# EAGLE design coil-control-UNO-shield-v1 (EAGLE 7.1.0)
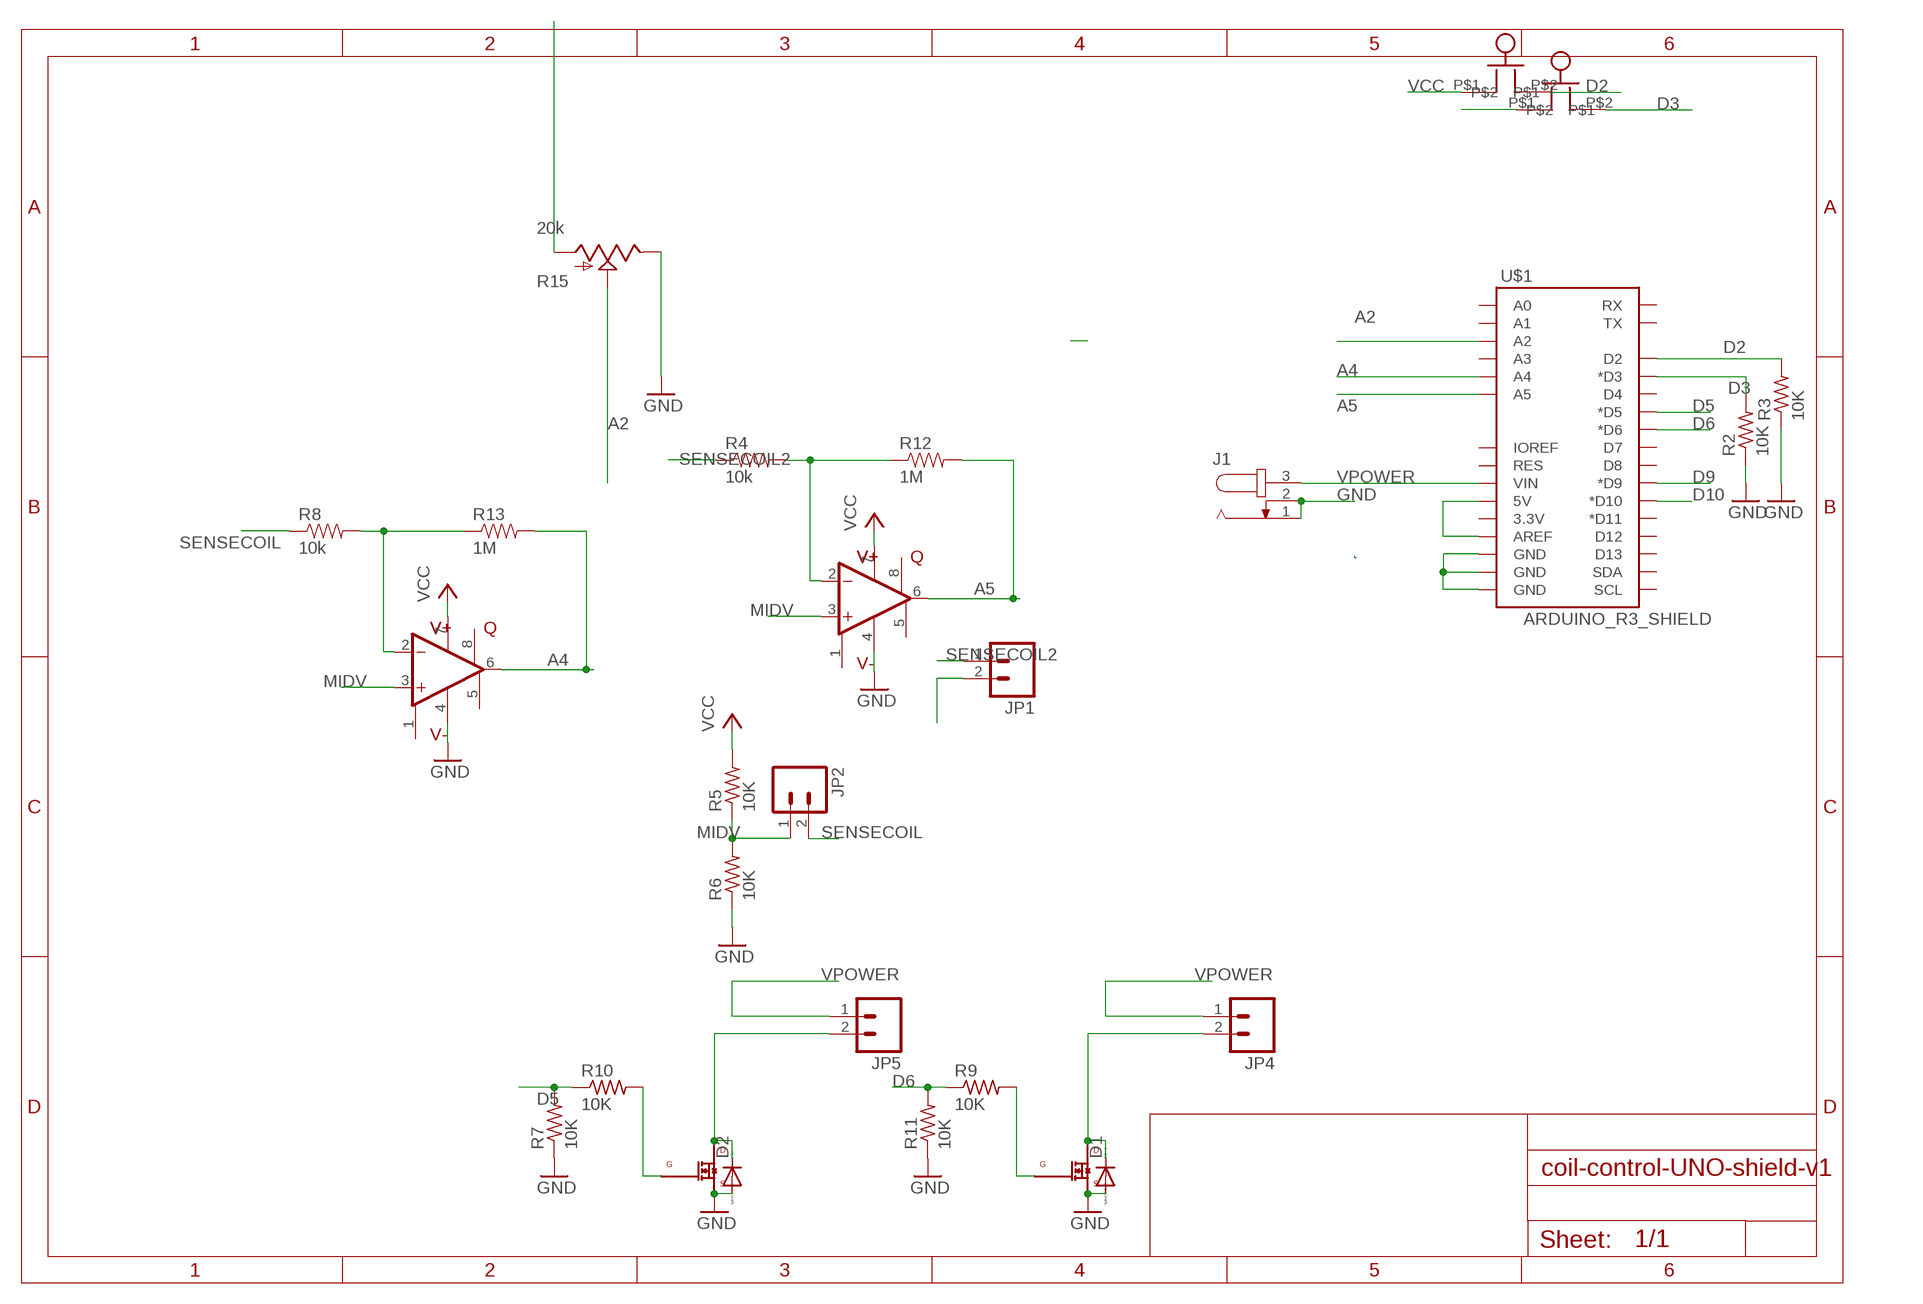
[diagram p0: schematic, sheet 1]

## Parts
D1  DIODE-DO-214AC  [DO-214AC]
D2  DIODE-DO-214AC  [DO-214AC]
J1  JACK-PLUG1  [SPC4078]
JP1  M02PTH  [1X02]
JP2  M02PTH  [1X02]
JP4  M02PTH  [1X02]
JP5  M02PTH  [1X02]
Q1  IRLML0060  [SOT-23]
Q2  IRLML0060  [SOT-23]
R2  10K  R-US_R0603  [R0603]
R3  10K  R-US_R0603  [R0603]
R4  10k  RESISTOR0603  [0603-RES]
R5  10K  R-US_R0603  [R0603]
R6  10K  R-US_R0603  [R0603]
R7  10K  R-US_R0603  [R0603]
R8  10k  RESISTOR0603  [0603-RES]
R9  10K  R-US_R0603  [R0603]
R10  10K  R-US_R0603  [R0603]
R11  10K  R-US_R0603  [R0603]
R12  1M  RESISTOR0805-RES  [0805]
R13  1M  RESISTOR0805-RES  [0805]
R15  20k  POTALPS-KIT  [ALPS_POT_KIT]
SW2  BUTTON  [BUTTON]
SW3  BUTTON  [BUTTON]
U2  LM4250  [DIP08]
U3  LM4250  [DIP08]
U$1  ARDUINO_R3_SHIELD  [UNO_R3_SHIELD]

## Nets
A2: R15.P$2(S) U$1.A2
A4: R13.2 U2.6(OUT) U$1.A4
A5: R12.2 U3.6(OUT) U$1.A5
D2: R3.2 SW2.P$2 U$1.D2
D3: R2.2 SW3.P$2 U$1.D3(*D3)
D5: R7.2 R10.1 U$1.D5(*D5)
D6: R9.1 R11.2 U$1.D6(*D6)
D9: U$1.D9(*D9)
D10: U$1.D10(*D10)
GND: D1.A D2.A J1.1 J1.2 Q1.2(SOURCE) Q2.2(SOURCE) R2.1 R3.1 R6.1 R7.1 R11.1 R15.P$1(E) U2.4(V-) U3.4(V-) U$1.GND@0(GND) U$1.GND@1(GND) U$1.GND@2(GND)
MIDV: JP1.2 JP2.1 R5.1 R6.2 U2.3(+IN) U3.3(+IN)
N$3: R4.2 R12.1 U3.2(-IN)
N$13: Q1.1(GATE) R9.2
N$14: R8.2 R13.1 U2.2(-IN)
N$15: D1.C JP4.2 Q1.3(DRAIN)
N$17: Q2.1(GATE) R10.2
N$18: D2.C JP5.2 Q2.3(DRAIN)
SENSECOIL: JP2.2 R8.1
SENSECOIL2: JP1.1 R4.1
VCC: R5.2 R15.P$3(A) SW2.P$1 SW3.P$1 U2.7(V+) U3.7(V+) U$1.5V U$1.AREF
VPOWER: J1.3 JP4.1 JP5.1 U$1.VIN
Unconnected: U2.1(NULL1) U2.5(NULL2) U2.8(QUIES) U3.1(NULL1) U3.5(NULL2) U3.8(QUIES) U$1.3.3V U$1.A0 U$1.A1 U$1.A3 U$1.D4 U$1.D7 U$1.D8 U$1.D11(*D11) U$1.D12 U$1.D13 U$1.IOREF U$1.RES U$1.RX U$1.SCL U$1.SDA U$1.TX

## Library data of the parts
D1 D2 = diode:DIODE-: DIODE
J1 = con-jack:JACK-PLUG: DC POWER JACK Power Jack, DC, Right Angle, Through Hole, Rated 5A at 16VDC, PC Terminals Distributor: Farnell (www.Farnell.de) Drawing: 84N1161.pdf / 84N1162.pdf Manufacturer: SPC Technology (www.spctechnology.com) Type: SPC4077 / SPC 4078; OC_FARNELL: unknown; OC_NEWARK: unknown
JP1 JP2 JP4 JP5 = SparkFun-Connectors:M02: Standard 2-pin 0.1" header. Use with - straight break away headers ( PRT-00116) - right angle break away headers (PRT-00553) - swiss pins (PRT-00743) - machine pins (PRT-00117) - female headers (PRT-00115) Molex polarized connector foot print use with: PRT-08233 with associated crimp pins and housings. 2.54_SCREWTERM for use with PRT-10571. 3.5mm Screw Terminal footprints for PRT-08084 5mm Screw Terminal footprints for use with PRT-08432
Q1 Q2 = spietz-library:IRLML0060
R2 R3 R5-R7 R9-R11 = resistor:R-US_: RESISTOR, American symbol
R4 R8 = SparkFun-Resistors:RESISTOR: Resistor Basic schematic elements and footprints for 0603, 1206, and PTH resistors.
R12 R13 = SparkFun-Passives:RESISTOR: Resistor Basic schematic elements and footprints for 0603, 1206, and PTH resistors.
R15 = SparkFun-Electromechanical:POT
SW2 SW3 = spietz-library:BUTTON
U2 U3 = spietz-library:LM4250
U$1 = SparkFun-Boards:ARDUINO_R3_SHIELD: Shield form compatible with the Arduino Uno R3.

## Net classes
0 default: width 0.203 mm
1 vcc: width 0.254 mm

## Board
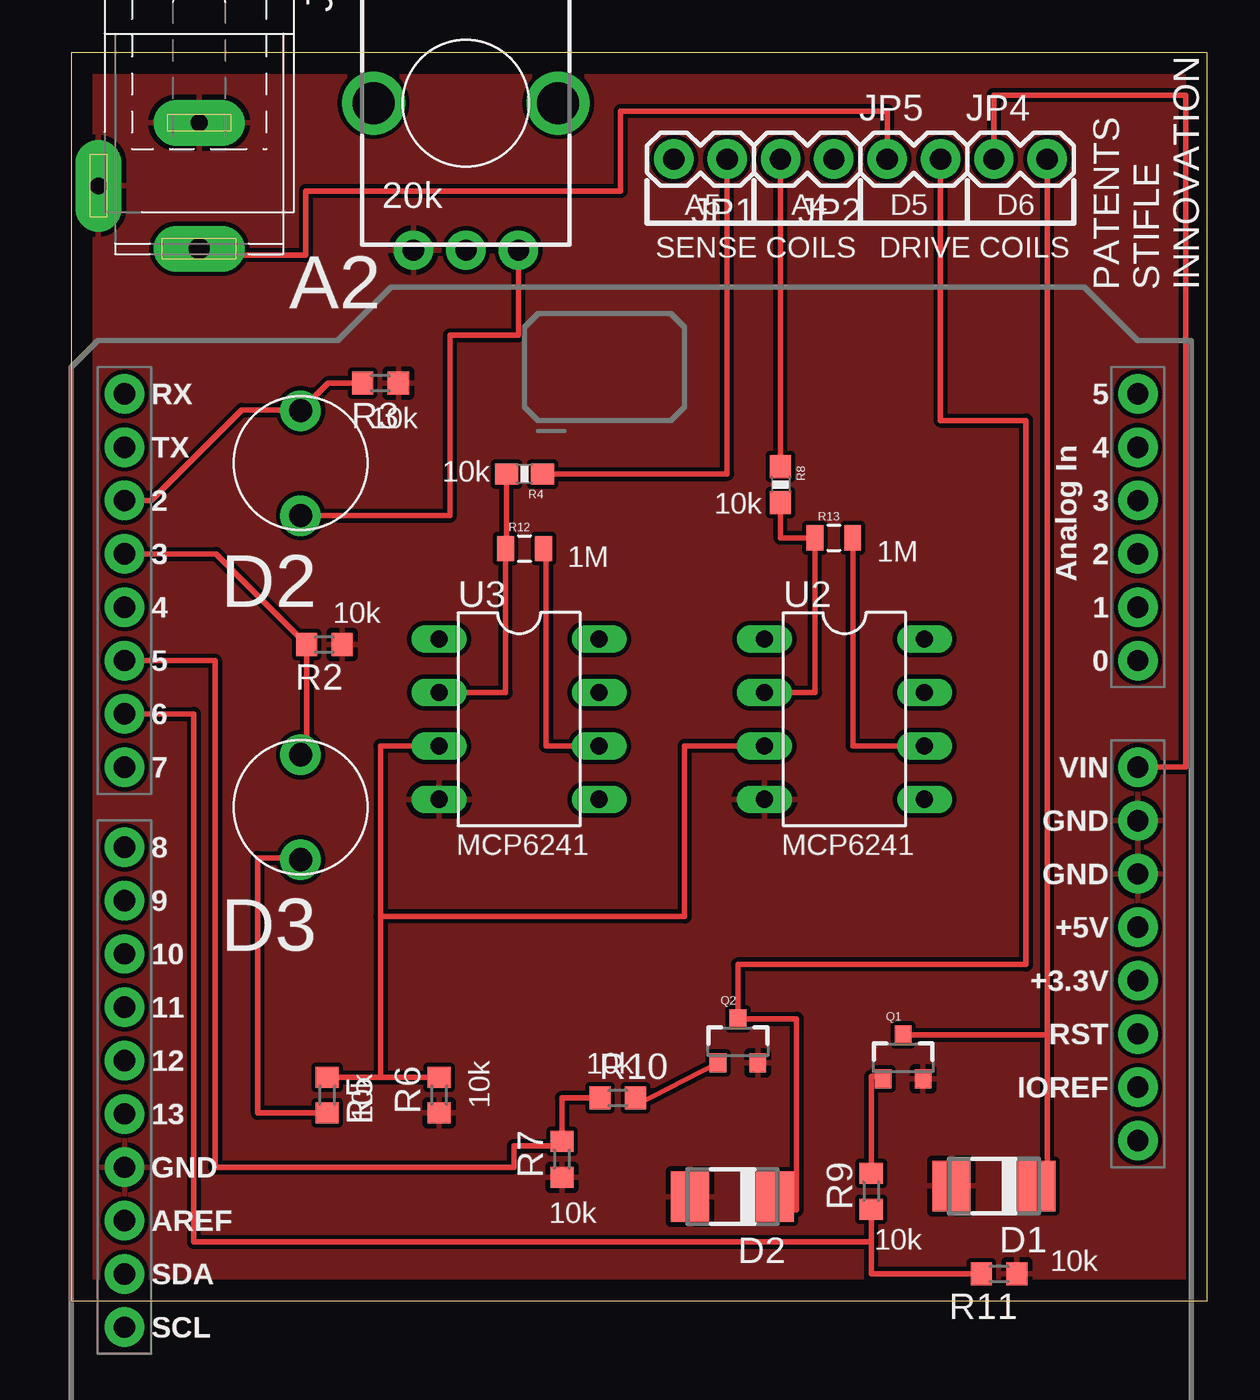
[diagram p1: board, top side]
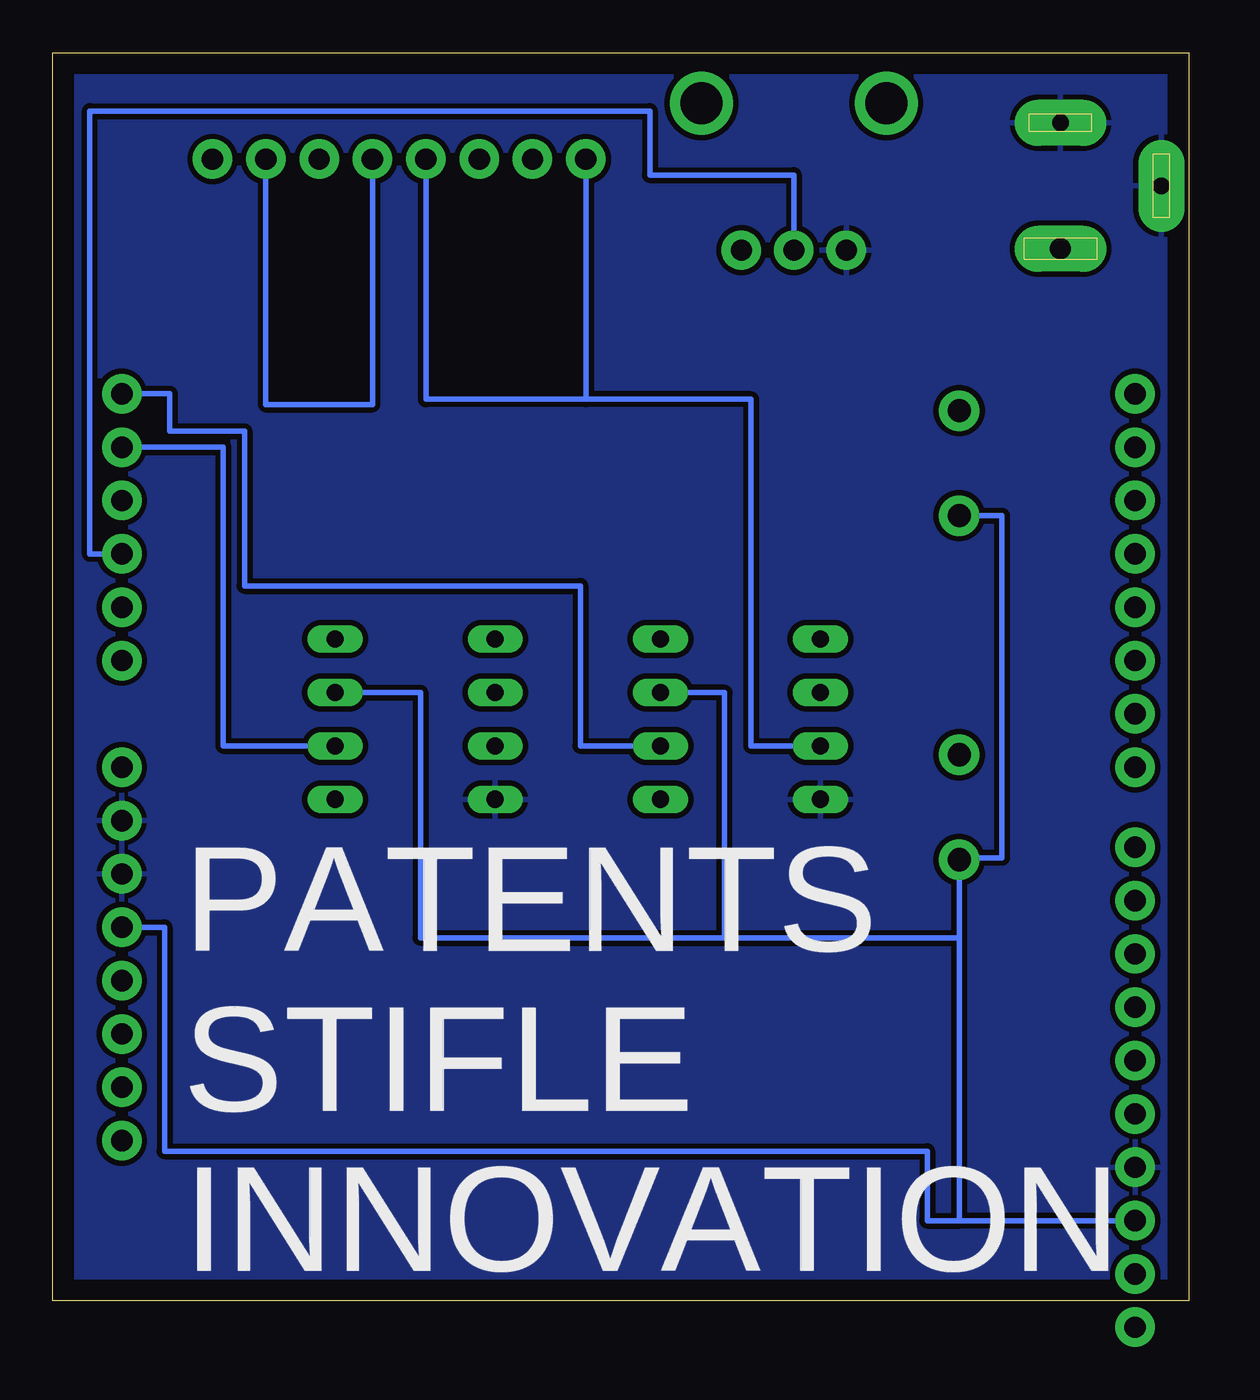
[diagram p2: board, bottom side, seen from below]

Size 54.1 x 59.44 mm. Coordinates in mm from the lower left corner, seen from the top.
Outline: 0,0 54.1,0 54.1,59.44 0,59.44 0,0
Copper layers (1*16): Top 0.035mm / dielectric 1.5mm / Bottom 0.035mm
Design rules "default": minimum track width 10mil, minimum drill 24mil, track to track 8mil, track to pad 8mil, pad to pad 8mil, via to via 8mil, smd to smd 8mil, copper to edge 40mil, drill to drill 8mil, minimum pad ring 10mil, minimum via ring 8mil, stop-mask expansion 4mil, vias tented up to drill 0mil, thermal gap 10mil

### Footprints (pad centres in the part's own frame; a part is rotated, then mirrored left to right if it is on the bottom)
DO-214AC = smd 1.8 x 2.4: A 2.025,0; C -2.025,0
SPC4078 = drill 0.8 pad 2.184 long: 1 -3,0; 2 0,-4.8 | drill 1 pad 2.184 long: 3 3,0
1X02 = drill 1.016 pad 1.88: 1 0,0; 2 2.54,0
SOT-23 = smd 0.8 x 0.9: 1 -0.95,-1; 2 0.95,-1; 3 0,1.1
R0603 = smd 1 x 1.1: 1 -0.85,0; 2 0.85,0
0603-RES = smd 1.1 x 1: 1 -0.85,0; 2 0.85,0
0805 = smd 0.8 x 1.2: 1 -0.9,0; 2 0.9,0
ALPS_POT_KIT = drill 1 pad 1.88: P$1 7,-2.5; P$2 7,0; P$3 7,2.5 | drill 2: P$4 0,-4.4; P$5 0,4.4
BUTTON = drill 1.1 pad 1.93: P$1 -2.499,0; P$2 2.499,0
DIP08 = drill 0.813 long: 1 -2.54,-3.81; 2 0,-3.81; 3 2.54,-3.81; 4 5.08,-3.81; 5 5.08,3.81; 6 2.54,3.81; 7 0,3.81; 8 -2.54,3.81
UNO_R3_SHIELD = drill 1.016 pad 1.88: 3.3V 50.8,26.67; 5V 50.8,29.21; A0 50.8,41.91; A1 50.8,44.45; A2 50.8,46.99; A3 50.8,49.53; A4 50.8,52.07; A5 50.8,54.61; AREF 2.54,15.24; D2 2.54,49.53; D3 2.54,46.99; D4 2.54,44.45; D5 2.54,41.91; D6 2.54,39.37; D7 2.54,36.83; D8 2.54,33.02; D9 2.54,30.48; D10 2.54,27.94; D11 2.54,25.4; D12 2.54,22.86; D13 2.54,20.32; GND@0 50.8,31.75; GND@1 50.8,34.29; GND@2 2.54,17.78; IOREF 50.8,21.59; NC 50.8,19.05; RES 50.8,24.13; RX 2.54,54.61; SCL 2.54,10.16; SDA 2.54,12.7; TX 2.54,52.07; VIN 50.8,36.83

### Placement (x,y rotation side)
D1  43.94,5.46 180 top
D2  31.5,4.95 180 top
J1  6.1,53.09 270 top
JP1  31.24,54.36 180 top
JP2  36.32,54.36 180 top
JP4  43.94,54.36 0 top
JP5  38.86,54.36 0 top
Q1  39.62,11.56 0 top
Q2  31.75,12.32 0 top
R2  12.07,31.24 180 top
R3  14.73,43.69 180 top
R4  21.59,39.37 180 top
R5  12.19,9.78 270 top
R6  17.53,9.78 90 top
R7  23.37,6.73 90 top
R8  33.78,38.86 270 top
R9  38.1,5.21 90 top
R10  26.04,9.65 0 top
R11  44.2,1.27 180 top
R12  21.59,35.81 0 top
R13  36.32,36.32 0 top
R15  18.8,57.02 270 top
SW2  10.92,39.88 90 top
SW3  10.92,23.5 90 top
U2  36.83,28.96 270 top
U3  21.34,28.96 270 top
U$1  0,-11.43 0 top

### Tracks (layer width: path | path; a pad name or v marks a point on that pad's centre or on a via)
A2
  Bottom 0.254: U$1.A2 52.32,35.56 52.32,56.64 25.65,56.64 25.65,53.59 18.8,53.59 R15.P$2
A4
  Top 0.254: U2.6 37.22,26.42 R13.2
  Bottom 0.254: U$1.A4 45.97,40.64 45.97,26.42 U2.6
A5
  Top 0.254: R12.2 22.61,35.81 22.61,26.42 U3.6
  Bottom 0.254: U$1.A5 48.51,43.18 48.51,41.4 44.96,41.4 44.96,34.04 28.96,34.04 28.96,26.42 U3.6
D2
  Top 0.254: U$1.D2 3.81,38.1 8.13,42.42 10.88,42.42 SW2.P$2 12.23,43.69 R3.2
D3
  Top 0.254: U$1.D3 6.9,35.56 R2.2 11.21,26.29 SW3.P$2
D5
  Top 0.254: U$1.D5 6.86,30.48 6.86,6.35 21.08,6.35 21.08,7.37 23.37,7.37 R7.2 23.37,9.65 R10.1
D6
  Top 0.254: U$1.D6 5.84,27.94 5.84,2.79 38.1,2.79 | 38.1,2.79 38.1,1.52 38.1,1.27 R11.2 | 38.1,2.79 R9.1
GND
  pour Top (isolate 0.152): -1.52,61.85 -1.78,-12.95 96.27,-12.83 96.27,61.72
  pour Bottom (isolate 0.254): -3.05,63.5 -3.3,-15.75 98.3,-14.86 98.04,63.88
MIDV
  Top 0.254: R5.1 14.73,10.63 | 14.73,10.63 R6.2 | U3.3 14.73,26.42 14.73,18.29 | 14.73,18.29 14.73,10.63 | U2.3 29.21,26.42 29.21,18.29 14.73,18.29
  Bottom 0.254: JP1.2 28.7,43.18 28.7,42.93 | 28.7,42.93 36.32,42.93 JP2.1 | U3.3 20.83,26.42 20.83,42.93 28.7,42.93
N$3
  Top 0.254: U3.2 20.69,28.96 R12.1 20.74,35.81 R4.2
N$13
  Top 0.254: R9.2 38.1,10.67 38.67,10.67 Q1.1
N$14
  Top 0.254: R8.2 33.78,36.32 R13.1 35.42,28.96 U2.2
N$15
  Top 0.254: Q1.3 46.48,12.66 | 46.48,12.66 JP4.2 | D1.C 46.48,4.95 46.48,12.66
N$17
  Top 0.254: Q2.1 26.89,9.29 R10.2
N$18
  Top 0.254: JP5.2 41.4,41.91 45.47,41.91 45.47,16 31.75,16 Q2.3 34.54,13.42 34.54,4.32 33.52,4.32 D2.C
SENSECOIL
  Top 0.254: R8.1 JP2.2
SENSECOIL2
  Top 0.254: R4.1 31.24,39.37 JP1.1
VCC
  Top 0.254: SW2.P$1 18.03,37.38 18.03,45.97 21.3,45.97 R15.P$3 | R5.2 8.89,8.93 8.89,21.08 10.92,21.08 SW3.P$1
  Bottom 0.254: 10.92,3.81 10.92,17.27 | 10.92,17.27 SW3.P$1 10.92,21.08 8.89,21.08 8.89,37.38 SW2.P$1 | U2.7 36.58,28.96 36.58,17.27 22.1,17.27 | 22.1,17.27 22.1,28.96 U3.7 | 22.1,17.27 10.92,17.27 | U$1.AREF 10.92,3.81 | 10.92,3.81 12.45,3.81 12.45,7.11 48.77,7.11 48.77,17.78 U$1.5V
VPOWER
  Top 0.254: U$1.VIN 53.09,25.4 53.09,57.4 43.94,57.4 JP4.1 | JP5.1 38.86,56.64 26.16,56.64 26.16,52.83 11.18,52.83 11.18,49.78 6.1,49.78 J1.3
  Bottom 0.254: JP4.1 43.94,42.67 38.86,42.67 JP5.1

### Text on the board
tPlace: A5 | A4 | D5 | D6 | A2 | SENSE COILS | DRIVE COILS | PATENTS / STIFLE / INNOVATION | 10k | 10k | 10k | D2 | 1M | 1M | 10k | MCP6241 | MCP6241 | D3 | 10k | 10k | 10k | 10k | 10k | 10k
bPlace: PATENTS / STIFLE / INNOVATION